# EAGLE design R113X (EAGLE 6.6.0)
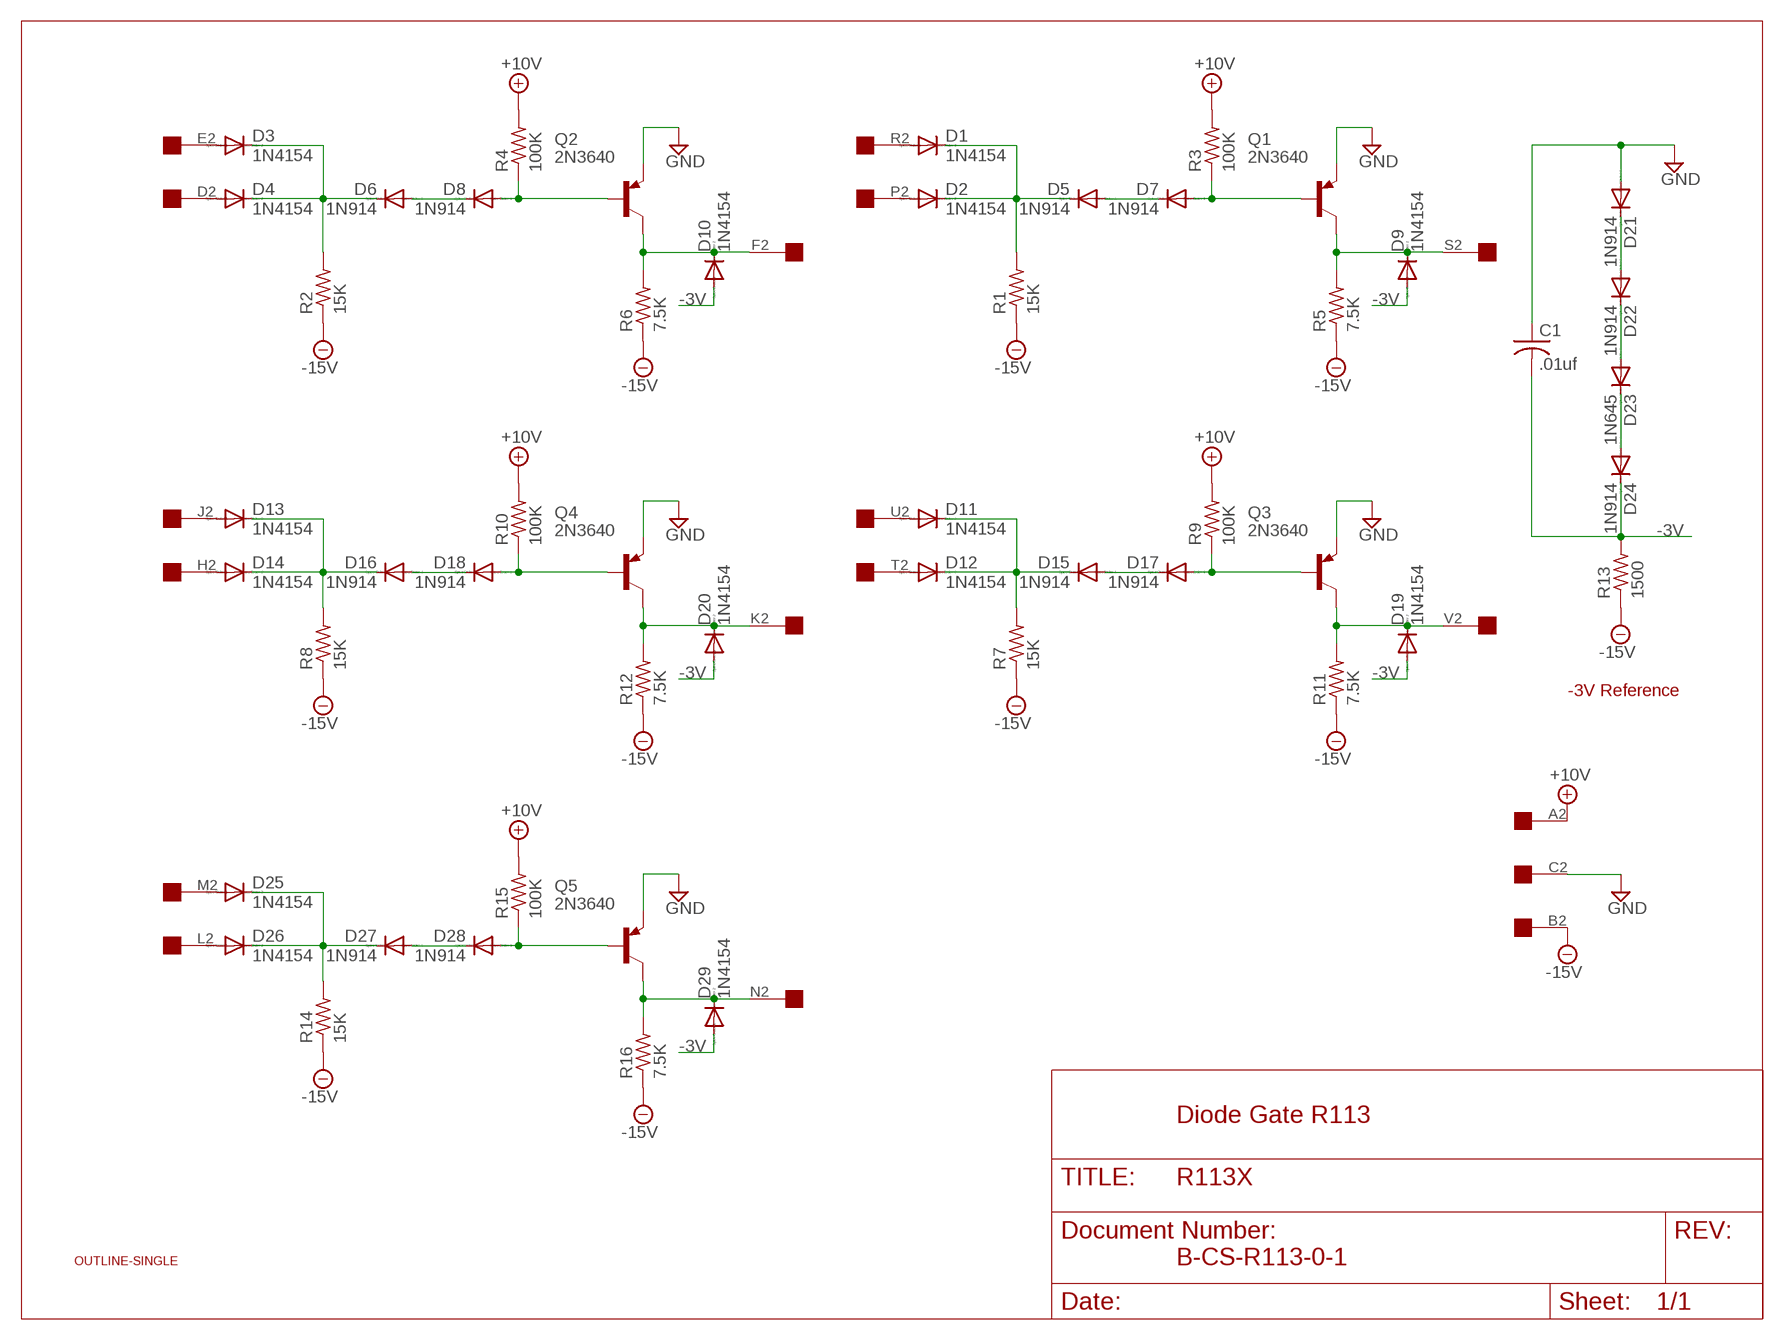
[diagram p0: schematic, sheet 1]

## Parts
C1  .01uf  C-US050-025X075  [C050-025X075]
D1  1N4154  1N4148DO35-10  [DO35-10]
D2  1N4154  1N4148DO35-10  [DO35-10]
D3  1N4154  1N4148DO35-10  [DO35-10]
D4  1N4154  1N4148DO35-10  [DO35-10]
D5  1N914  1N4148DO35-10  [DO35-10]
D6  1N914  1N4148DO35-10  [DO35-10]
D7  1N914  1N4148DO35-10  [DO35-10]
D8  1N914  1N4148DO35-10  [DO35-10]
D9  1N4154  1N4148DO35-10  [DO35-10]
D10  1N4154  1N4148DO35-10  [DO35-10]
D11  1N4154  1N4148DO35-10  [DO35-10]
D12  1N4154  1N4148DO35-10  [DO35-10]
D13  1N4154  1N4148DO35-10  [DO35-10]
D14  1N4154  1N4148DO35-10  [DO35-10]
D15  1N914  1N4148DO35-10  [DO35-10]
D16  1N914  1N4148DO35-10  [DO35-10]
D17  1N914  1N4148DO35-10  [DO35-10]
D18  1N914  1N4148DO35-10  [DO35-10]
D19  1N4154  1N4148DO35-10  [DO35-10]
D20  1N4154  1N4148DO35-10  [DO35-10]
D21  1N914  1N4148DO35-10  [DO35-10]
D22  1N914  1N4148DO35-10  [DO35-10]
D23  1N645  1N4148DO35-10  [DO35-10]
D24  1N914  1N4148DO35-10  [DO35-10]
D25  1N4154  1N4148DO35-10  [DO35-10]
D26  1N4154  1N4148DO35-10  [DO35-10]
D27  1N914  1N4148DO35-10  [DO35-10]
D28  1N914  1N4148DO35-10  [DO35-10]
D29  1N4154  1N4148DO35-10  [DO35-10]
Q1  2N3640  2N3637  [TO39]
Q2  2N3640  2N3637  [TO39]
Q3  2N3640  2N3637  [TO39]
Q4  2N3640  2N3637  [TO39]
Q5  2N3640  2N3637  [TO39]
R1  15K  R-US_0207/10  [0207/10]
R2  15K  R-US_0207/10  [0207/10]
R3  100K  R-US_0207/10  [0207/10]
R4  100K  R-US_0207/10  [0207/10]
R5  7.5K  R-US_0207/10  [0207/10]
R6  7.5K  R-US_0207/10  [0207/10]
R7  15K  R-US_0207/10  [0207/10]
R8  15K  R-US_0207/10  [0207/10]
R9  100K  R-US_0207/10  [0207/10]
R10  100K  R-US_0207/10  [0207/10]
R11  7.5K  R-US_0207/10  [0207/10]
R12  7.5K  R-US_0207/10  [0207/10]
R13  1500  R-US_0207/10  [0207/10]
R14  15K  R-US_0207/10  [0207/10]
R15  100K  R-US_0207/10  [0207/10]
R16  7.5K  R-US_0207/10  [0207/10]
U$1  OUTLINE-SINGLE  [SINGLE]
U$2  EDGE-1  [EDGE-CON1]

## Nets
+10V [Power]: R3.2 R4.2 R9.2 R10.2 R15.2 U$2.A2
-3V [Power]: C1.2 D9.A D10.A D19.A D20.A D24.C D29.A R13.2
-15V [Power]: R1.1 R2.1 R5.1 R6.1 R7.1 R8.1 R11.1 R12.1 R13.1 R14.1 R16.1 U$2.B2
GND [Power]: C1.1 D21.A Q1.1(E) Q2.1(E) Q3.1(E) Q4.1(E) Q5.1(E) U$2.C2
N$1: D14.A U$2.H2
N$2: D18.A Q4.2(B) R10.1
N$3: D21.C D22.A
N$4: D20.C Q4.3(C) R12.2 U$2.K2
N$5: D11.A U$2.U2
N$6: D13.C D14.C D16.C R8.2
N$7: D16.A D18.C
N$8: D28.A Q5.2(B) R15.1
N$9: D29.C Q5.3(C) R16.2 U$2.N2
N$10: D26.A U$2.L2
N$11: D25.C D26.C D27.C R14.2
N$12: D27.A D28.C
N$13: D22.C D23.A
N$14: D13.A U$2.J2
N$15: D7.A Q1.2(B) R3.1
N$16: D23.C D24.A
N$17: D9.C Q1.3(C) R5.2 U$2.S2
N$18: D2.A U$2.P2
N$19: D8.A Q2.2(B) R4.1
N$20: D10.C Q2.3(C) R6.2 U$2.F2
N$21: D4.A U$2.D2
N$22: D3.C D4.C D6.C R2.2
N$23: D6.A D8.C
N$24: D1.C D2.C D5.C R1.2
N$25: D5.A D7.C
N$26: D17.A Q3.2(B) R9.1
N$27: D11.C D12.C D15.C R7.2
N$28: D15.A D17.C
N$29: D1.A U$2.R2
N$30: D12.A U$2.T2
N$31: D25.A U$2.M2
N$32: D19.C Q3.3(C) R11.2 U$2.V2
N$39: D3.A U$2.E2

## Notes on the sheet
- -3V Reference
- Diode Gate R113
- B-CS-R113-0-1

## Library data of the parts
C1 = rcl:C-US: CAPACITOR, American symbol
D1-D29 = diode:1N4148: DIODE high speed (Philips)
Q1-Q5 = transistor-pnp:2N3637*: PNP Transistror
R1-R16 = rcl:R-US_: RESISTOR, American symbol
U$1 = dec-con:OUTLINE-*: Board outlines for DEC boards.
U$2 = dec-con:EDGE-1: Single-Sided DEC Edge Connector -- (side 2)

## Net classes
1 Power: width 0.813 mm

## Board
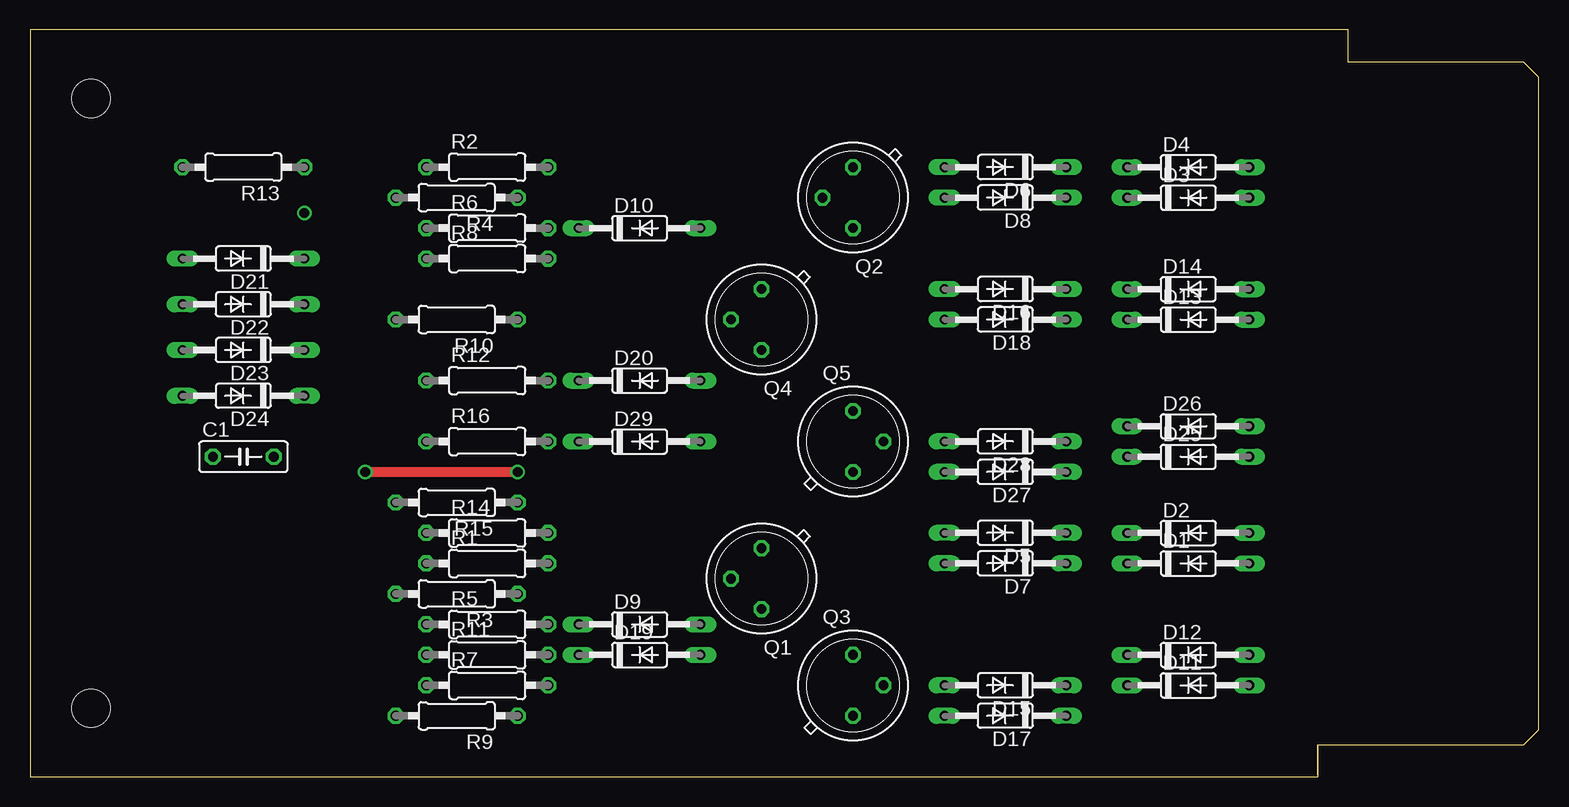
[diagram p1: board, top side]
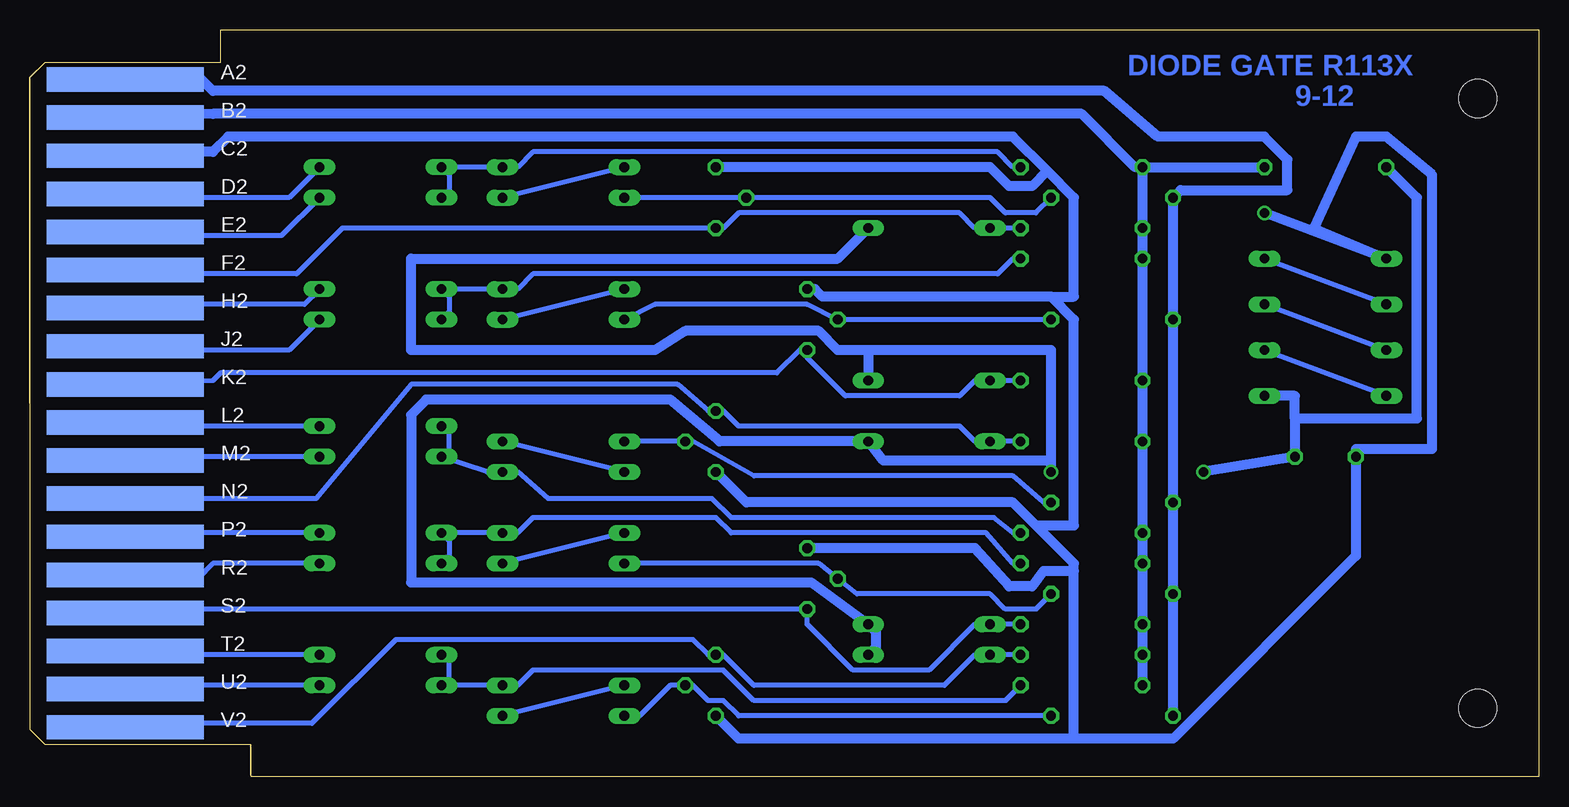
[diagram p2: board, bottom side, seen from below]

Size 125.73 x 62.23 mm. Coordinates in mm from the lower left corner, seen from the top.
Copper layers (1+16): Top 0.035mm / dielectric 1.5mm / Bottom 0.035mm
Design rules "16mils": minimum track width 16mil, minimum drill 32mil, track to track 15mil, track to pad 10mil, pad to pad 10mil, via to via 10mil, smd to smd 10mil, copper to edge 13mil, drill to drill 10mil, minimum pad ring 10mil, minimum via ring 8mil, stop-mask expansion 0mil, vias tented up to drill 0mil, thermal gap 10mil

### Footprints (pad centres in the part's own frame; a part is rotated, then mirrored left to right if it is on the bottom)
C050-025X075 = drill 0.813 octagon: 1 -2.54,0; 2 2.54,0
DO35-10 = drill 0.813 long: A 5.08,0; C -5.08,0
TO39 = drill 0.813 octagon: 1 0,-2.54; 2 2.54,0; 3 0,2.54
0207/10 = drill 0.813 octagon: 1 -5.08,0; 2 5.08,0
SINGLE = hole 3.175: 120.65,56.515; 120.65,5.715
EDGE-CON1 = smd 13.106 x 2.032 bottom: A2 7.938,4.128; B2 7.938,7.303; C2 7.938,10.477; D2 7.938,13.652; E2 7.938,16.828; F2 7.938,20.003; H2 7.938,23.177; J2 7.938,26.352; K2 7.938,29.527; L2 7.938,32.703; M2 7.938,35.877; N2 7.938,39.053; P2 7.938,42.227; R2 7.938,45.403; S2 7.938,48.578; T2 7.938,51.752; U2 7.938,54.928; V2 7.938,58.102

### Placement (x,y rotation side)
C1  17.78,26.67 0 top
D1  96.52,17.78 0 top
D2  96.52,20.32 0 top
D3  96.52,48.26 0 top
D4  96.52,50.8 0 top
D5  81.28,20.32 180 top
D6  81.28,50.8 180 top
D7  81.28,17.78 180 top
D8  81.28,48.26 180 top
D9  50.8,12.7 0 top
D10  50.8,45.72 0 top
D11  96.52,7.62 0 top
D12  96.52,10.16 0 top
D13  96.52,38.1 0 top
D14  96.52,40.64 0 top
D15  81.28,7.62 180 top
D16  81.28,40.64 180 top
D17  81.28,5.08 180 top
D18  81.28,38.1 180 top
D19  50.8,10.16 0 top
D20  50.8,33.02 0 top
D21  17.78,43.18 180 top
D22  17.78,39.37 180 top
D23  17.78,35.56 180 top
D24  17.78,31.75 180 top
D25  96.52,26.67 0 top
D26  96.52,29.21 0 top
D27  81.28,25.4 180 top
D28  81.28,27.94 180 top
D29  50.8,27.94 0 top
Q1  60.96,16.51 180 top
Q2  68.58,48.26 180 top
Q3  68.58,7.62 0 top
Q4  60.96,38.1 180 top
Q5  68.58,27.94 0 top
R1  38.1,17.78 0 top
R2  38.1,50.8 0 top
R3  35.56,15.24 180 top
R4  35.56,48.26 180 top
R5  38.1,12.7 0 top
R6  38.1,45.72 0 top
R7  38.1,7.62 0 top
R8  38.1,43.18 0 top
R9  35.56,5.08 180 top
R10  35.56,38.1 180 top
R11  38.1,10.16 0 top
R12  38.1,33.02 0 top
R13  17.78,50.8 180 top
R14  38.1,20.32 0 top
R15  35.56,22.86 180 top
R16  38.1,27.94 0 top
U$1  125.73,62.23 180 top
U$2  125.73,62.23 180 top

### Tracks (layer width: path | path; a pad name or v marks a point on that pad's centre or on a via)
+10V
  Bottom 0.813: R9.2 R3.2 R15.2 R10.2 R4.2 29.84,48.9 20.95,48.9 20.95,51.44 22.86,53.34 31.75,53.34 36.2,57.15 110.49,57.15 111.76,58.42 U$2.A2
-3V  (via drill 0.81)
  Top 0.813: v27.94,25.4 v40.64,25.4
  Bottom 0.813: 20.32,29.84 C1.2 v27.94,25.4 | 20.32,29.84 20.32,31.75 D24.C | 55.88,35.56 D20.A | v40.64,25.4 40.64,26.35 | 40.64,26.35 40.64,35.56 55.88,35.56 | 40.64,26.35 54.61,26.35 D29.A 68.26,27.94 72.39,31.43 92.71,31.43 93.98,30.16 93.98,16.19 60.64,16.19 D9.A 55.24,12.06 55.24,10.79 D19.A | D10.A 58.42,43.18 93.98,43.18 93.98,35.56 73.66,35.56 71.12,37.15 60.01,37.15 58.42,35.56 55.88,35.56 | R13.2 10.16,48.26 10.16,29.84 20.32,29.84
-15V
  Bottom 0.813: R2.1 R13.1 | R2.1 R6.1 R8.1 R12.1 R16.1 R14.1 R1.1 R5.1 R11.1 R7.1 | U$2.B2 110.49,55.24 38.1,55.24 33.66,50.8 R2.1
GND  (via drill 0.81)
  Bottom 0.813: Q3.1 66.67,3.17 38.73,3.17 | 38.73,3.17 30.48,3.17 15.24,18.41 C1.1 15.24,27.3 8.89,27.3 8.89,50.16 12.7,53.34 15.24,53.34 18.73,45.72 D21.A v22.86,46.99 | 41.91,20.95 38.73,17.78 38.73,17.14 | 41.91,20.95 43.81,22.86 66.04,22.86 Q5.1 | 38.73,3.17 38.73,17.14 | 40.64,40.01 59.69,40.01 60.33,40.64 Q4.1 | 40.64,40.01 38.73,38.1 38.73,20.95 41.91,20.95 | 40.96,50.48 38.73,48.26 38.73,40.01 40.64,40.01 | 40.96,50.48 43.81,53.34 109.22,53.34 110.49,52.07 111.76,52.07 U$2.C2 | Q2.1 45.72,50.8 44.13,49.21 42.23,49.21 40.96,50.48 | Q1.1 46.99,19.05 44.13,15.88 42.23,15.88 41.27,17.14 38.73,17.14
N$1
  Bottom 0.406: D14.A 102.87,39.37 112.39,39.37 U$2.H2
N$2
  Bottom 0.406: R10.1 Q4.2 60.96,39.37 73.66,39.37 D18.A
N$3
  Bottom 0.406: D22.A D21.C
N$4
  Bottom 0.406: R12.2 D20.C 46.99,33.02 48.26,31.75 57.78,31.75 60.96,34.92 Q4.3 61.59,35.56 63.5,33.66 109.86,33.66 110.49,33.02 U$2.K2
N$5
  Bottom 0.406: D11.A 111.76,7.62 U$2.U2
N$6
  Bottom 0.406: D13.C 90.81,38.73 90.81,40.01 D14.C D16.C 85.09,40.64 83.82,41.91 45.09,41.91 43.81,43.18 R8.2
N$7
  Bottom 0.406: D16.A D18.C
N$8
  Bottom 0.406: R15.1 41.27,22.86 43.81,25.08 65.41,25.08 70.48,27.94 Q5.2 D28.A
N$9
  Bottom 0.406: R16.2 D29.C 46.99,27.94 48.26,29.21 66.67,29.21 67.94,30.48 Q5.3 69.22,30.48 71.75,32.7 93.98,32.7 101.92,23.18 110.81,23.18 U$2.N2
N$10
  Bottom 0.406: D26.A 111.76,29.21 U$2.L2
N$11
  Bottom 0.406: D26.C 90.81,28.57 90.81,27.3 D25.C 87.63,25.4 D27.C 85.09,25.4 82.55,23.18 68.9,23.18 67.31,21.59 45.4,21.59 43.81,20.32 R14.2
N$12
  Bottom 0.406: D27.A D28.C
N$13
  Bottom 0.406: D23.A D22.C
N$14
  Bottom 0.406: D13.A 104.14,35.56 113.03,35.56 U$2.J2
N$15
  Bottom 0.406: R3.1 41.91,13.97 44.45,13.97 45.72,15.24 56.83,15.24 Q1.2 60.01,17.78 D7.A
N$16
  Bottom 0.406: D24.A D23.C
N$17
  Bottom 0.406: R5.2 D9.C 46.99,12.7 50.8,8.89 57.15,8.89 60.96,12.7 Q1.3 111.76,13.97 U$2.S2
N$18
  Bottom 0.406: D2.A 111.76,20.32 U$2.P2
N$19
  Bottom 0.406: R4.1 41.91,46.99 44.45,46.99 45.72,48.26 Q2.2 D8.A
N$20
  Bottom 0.406: R6.2 D10.C 46.99,45.72 48.26,46.99 66.67,46.99 67.94,45.72 Q2.3 99.69,45.72 103.5,41.91 113.03,41.91 U$2.F2
N$21
  Bottom 0.406: D4.A 104.14,48.26 113.03,48.26 U$2.D2
N$22
  Bottom 0.406: D3.C 90.81,48.9 90.81,50.16 D4.C D6.C 85.09,50.8 83.82,52.07 45.09,52.07 43.81,50.8 R2.2
N$23
  Bottom 0.406: D6.A D8.C
N$24
  Bottom 0.406: R1.2 43.81,17.78 46.04,20.32 67.31,20.32 68.58,21.59 83.82,21.59 85.09,20.32 D5.C D2.C 90.81,19.68 90.81,18.41 D1.C
N$25
  Bottom 0.406: D5.A D7.C
N$26
  Bottom 0.406: R9.1 66.67,5.08 67.94,6.35 69.22,6.35 70.48,7.62 Q3.2 72.39,7.62 74.93,5.08 D17.A
N$27
  Bottom 0.406: D12.C 90.81,9.53 90.81,8.26 D11.C D15.C 85.09,7.62 83.82,8.89 67.94,8.89 65.41,6.35 44.45,6.35 R7.2
N$28
  Bottom 0.406: D15.A D17.C
N$29
  Bottom 0.406: D1.A 110.49,17.78 111.76,16.51 U$2.R2
N$30
  Bottom 0.406: D12.A 111.76,10.16 U$2.T2
N$31
  Bottom 0.406: D25.A 111.76,26.67 U$2.M2
N$32
  Bottom 0.406: R11.2 D19.C 46.99,10.16 49.53,7.62 65.41,7.62 67.94,10.16 Q3.3 69.22,10.16 70.48,11.43 95.25,11.43 102.23,4.45 111.76,4.45 U$2.V2
N$39
  Bottom 0.406: D3.A 104.78,45.09 113.03,45.09 U$2.E2

### Text on the board
Bottom: DIODE GATE R113X | 9-12